# EAGLE design PIR_datalogger (EAGLE 7.7.0)
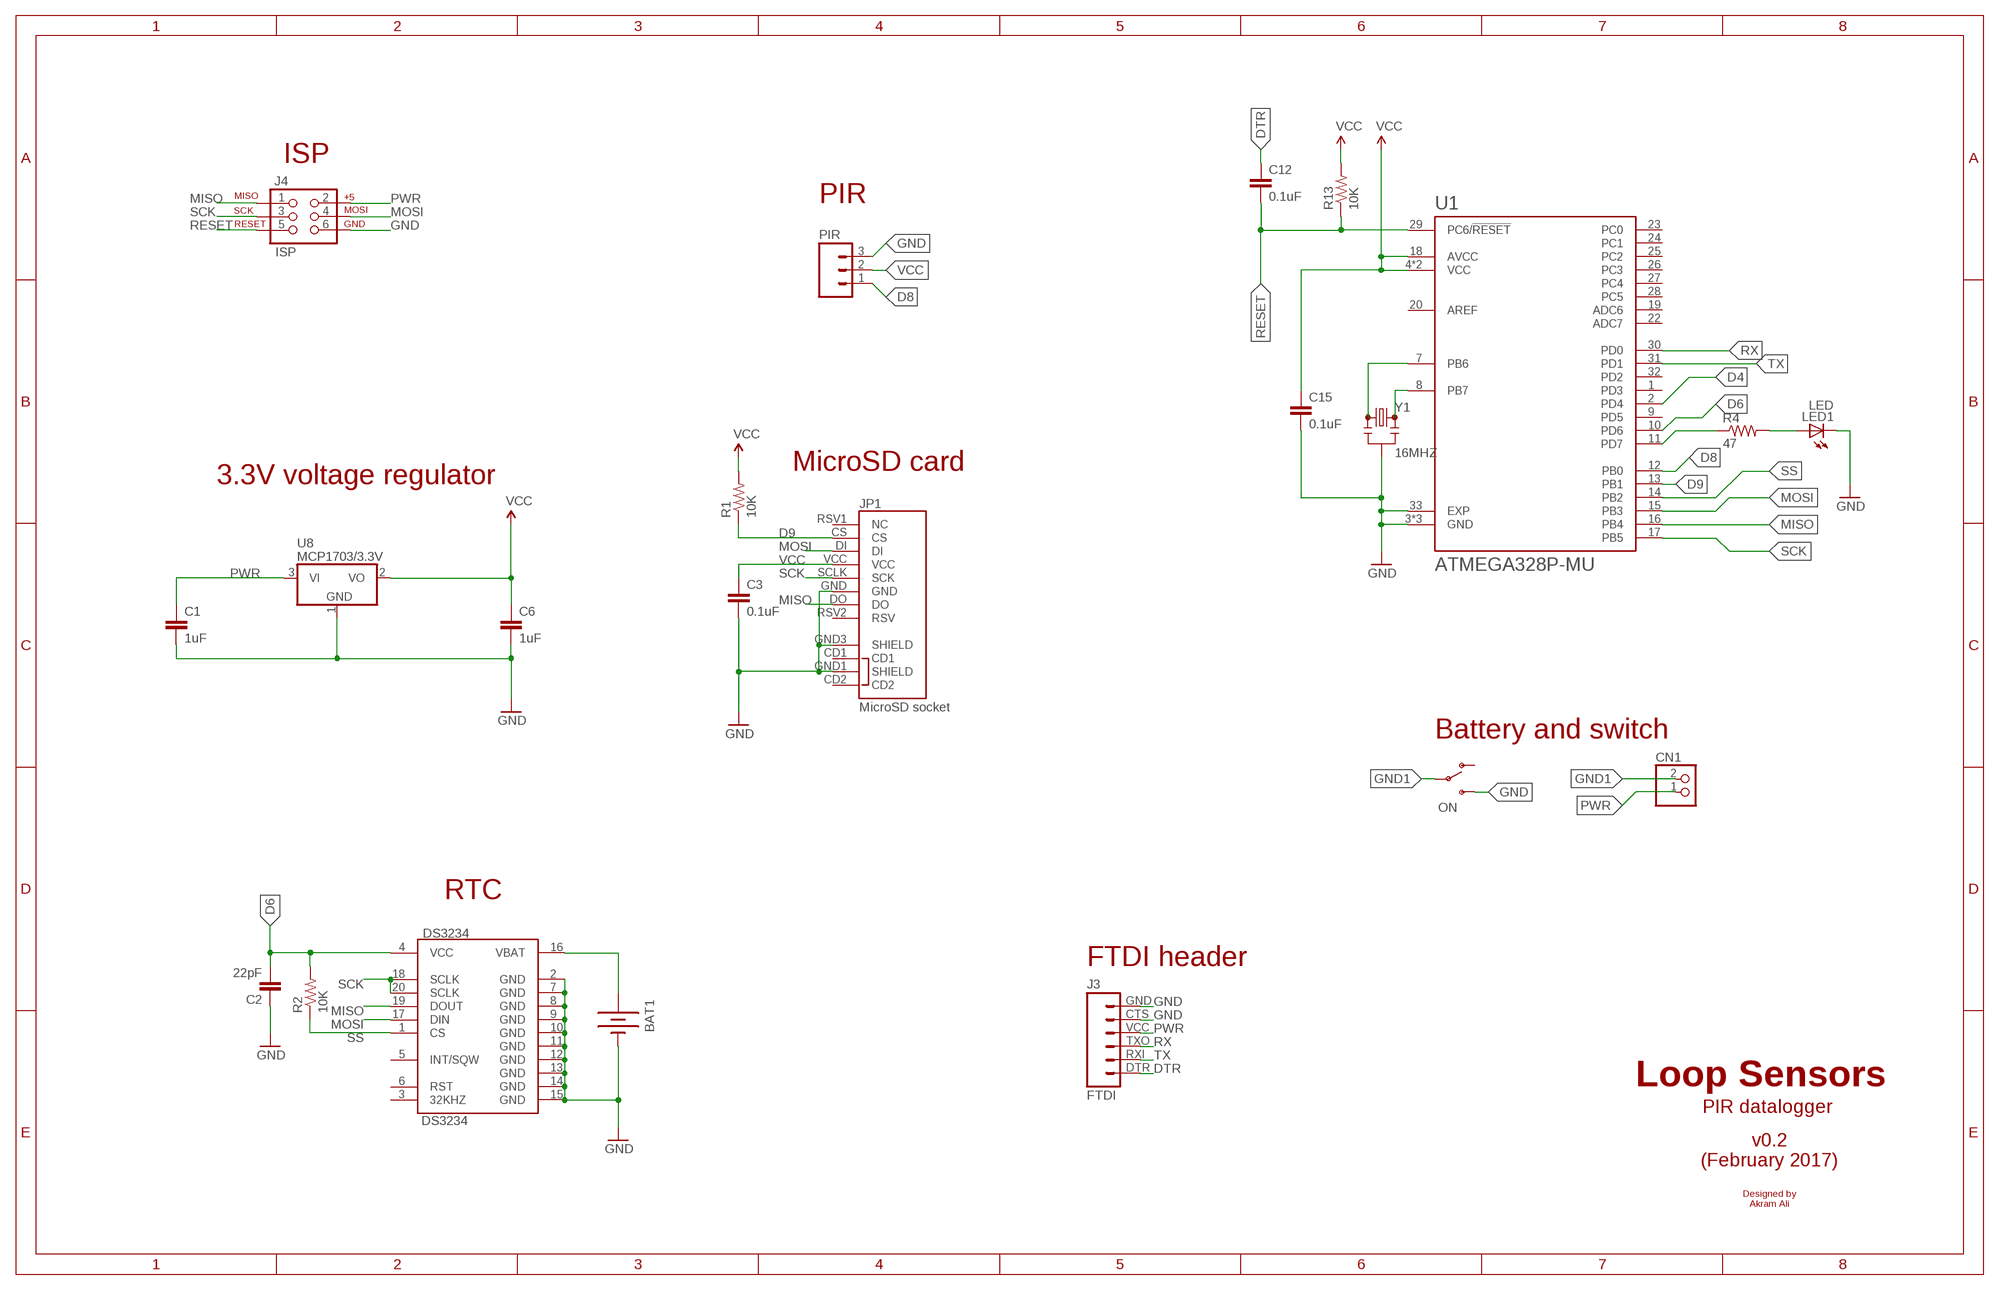
[diagram p0: schematic, sheet 1]

## Parts
BAT1  BATTERY12MM  [BATTCON_12MM]
C1  1uF  CAP0805  [0805]
C2  22pF  CAP0805  [0805]
C3  0.1uF  CAP0805  [0805]
C6  1uF  CAP0805  [0805]
C12  0.1uF  CAP0805  [0805]
C15  0.1uF  CAP0805  [0805]
CN1  JST_2PIN-SMT-RA  [JST-PH-2-SMT-RA]
DS3234  DS3234  [DS3234]
J3  FTDI  FTDI_BASICPTH  [FTDI_BASIC]
J4  ISP  AVR_SPI_PRG_6PTH  [2X3]
JP1  MicroSD socket  USD-SOCKETNEW  [MICRO-SD-SOCKET-PP]
LED1  LED  LEDCHIPLED_0805  [CHIPLED_0805]
ON  SWITCH-SPDT-SMD-A  [SWITCH-SPST-SMD-A]
PIR  M03PTH  [1X03]
R1  10K  RESISTOR0805-RES  [0805]
R2  10K  RESISTOR0805-RES  [0805]
R4  47  RESISTOR0805-RES  [0805]
R13  10K  RESISTOR0805-RES  [0805]
U1  ATMEGA328P-MU  [QFN50P500X500X100-33N]
U8  MCP1703/3.3V  MCP1703CB  [SOT23]
Y1  16MHZ  RESONATOR16MHZ  [RESONATOR-SMD]

## Nets
D4: U1.2(PD4)
D6: C2.2 DS3234.4(VCC) R2.2 U1.10(PD6)
D8: PIR.1 U1.12(PB0)
D9: JP1.CS R1.1 U1.13(PB1)
DTR: C12.1 J3.DTR
GND: BAT1.GND(-) C1.2 C2.1 C3.2 C6.2 C15.2 DS3234.2(GND) DS3234.7(GND) DS3234.8(GND) DS3234.9(GND) DS3234.10(GND) DS3234.11(GND) DS3234.12(GND) DS3234.13(GND) DS3234.14(GND) DS3234.15(GND) J3.CTS J3.GND J4.6 JP1.GND JP1.GND1(SHIELD) JP1.GND3(SHIELD) LED1.C ON.3(S) PIR.3 U1.3(GND) U1.5(GND) U1.21(GND) U1.33(EXP) U8.1(GND) Y1.2
GND1: CN1.2 ON.2(P)
MISO: DS3234.19(DOUT) J4.1 JP1.DO U1.16(PB4)
MOSI: DS3234.17(DIN) J4.4 JP1.DI U1.15(PB3)
N$1: R4.1 U1.11(PD7)
N$3: LED1.A R4.2
N$4: U1.8(PB7) Y1.3
N$5: U1.7(PB6) Y1.1
N$8: BAT1.PWR@1(+) DS3234.16(VBAT)
PWR: C1.1 CN1.1 J3.VCC J4.2 U8.3(VI)
RESET: C12.2 J4.5 R13.1 U1.29(PC6/!RESET)
RX: J3.TXO U1.30(PD0)
SCK: DS3234.18(SCLK) DS3234.20(SCLK) J4.3 JP1.SCLK(SCK) U1.17(PB5)
SS: DS3234.1(CS) R2.1 U1.14(PB2)
TX: J3.RXI U1.31(PD1)
VCC: C3.1 C6.1 C15.1 JP1.VCC PIR.2 R1.2 R13.2 U1.4(VCC) U1.6(VCC) U1.18(AVCC) U8.2(VO)
Unconnected: DS3234.3(32KHZ) DS3234.5(INT/SQW) DS3234.6(RST) JP1.CD1 JP1.CD2 JP1.RSV1(NC) JP1.RSV2(RSV) ON.1(O) U1.1(PD3) U1.9(PD5) U1.19(ADC6) U1.20(AREF) U1.22(ADC7) U1.23(PC0) U1.24(PC1) U1.25(PC2) U1.26(PC3) U1.27(PC4) U1.28(PC5) U1.32(PD2)

## Notes on the sheet
- ISP
- PIR
- MicroSD card
- 3.3V voltage regulator
- Battery and switch
- RTC
- FTDI header
- Loop Sensors
- PIR datalogger
- v0.2
  (February 2017)
- Designed by
  Akram Ali

## Library data of the parts
BAT1 = SparkFun-Electromechanical:BATTERY: Battery Holders Various common sizes : AA, AAA, 18650 (PRT-12895), 20mm coin cell and 12mm coin cell. 20MM_4LEGS, BATT-10373; MPN: 3000; PROD_ID: BATT-08044
C1 C6 = SparkFun-Capacitors:CAP: Capacitor Standard 0603 ceramic capacitor, and 0.1" leaded capacitor.; MPN: CC0805KKX7R7BB105
C2 C3 C12 C15 = SparkFun-Passives:CAP: Capacitor Standard 0603 ceramic capacitor, and 0.1" leaded capacitor.; MPN: AC0805KRX7R9BB104
CN1 = adafruit:JST_2PIN: JST 2-Pin Connectors of various flavors SMT-RA (S2B-PH-SM4) 4UConnector #17311 SMT (B2B-PH-SM4) THM-RA (S2B-PH) THM (B2B-PH)
DS3234 = SparkFun-FreqCtrl:DS3234: SPI RTC module with battery backup and internal clock.; MPN: DS3234S#
J3 = SparkFun-Connectors:FTDI_BASIC: FTDI Basic header with labels
J4 = SparkFun-Connectors:AVR_SPI_PRG_6: AVR ISP 6 Pin This is the reduced ISP connector for AVR programming. Common on Arduino. This footprint will take up less PCB space and can be used with a 10-pin to 6-pin adapter such as SKU: BOB-08508 **Special note about "TEST_POINT" package. The stop mask is on the top side, so if you want your programming test points to be on the bottom of your board, make sure to place this package on the bottom side of the board. This also ensure that the orientation to program from the bottom side will be correct.
JP1 = SparkFun-Connectors:USD-SOCKET: microSD Socket Push-push type uSD socket. Schematic element and footprint production proven. Spark Fun Electronics SKU : PRT-00127. tDoc lines correctly indicate media card edge positions when inserting (unlocked, locked, depressed). NOTE: CD1 and CD2 are connected internally; PROD_ID: CONN-07820
LED1 = adafruit:LED: LED OSRAM: - CHIPLED LG R971, LG N971, LY N971, LG Q971, LY Q971, LO R971, LY R971 LH N974, LH R974 LS Q976, LO Q976, LY Q976 LO Q996 - Hyper CHIPLED LW Q18S LB Q993, LB Q99A, LB R99A - SideLED LS A670, LO A670, LY A670, LG A670, LP A670 LB A673, LV A673, LT A673, LW A673 LH A674 LY A675 LS A676, LA A676, LO A676, LY A676, LW A676 LS A679, LY A679, LG A679 - Hyper Micro SIDELED® LS Y876, LA Y876, LO Y876, LY Y876 LT Y87S - SmartLED LW L88C, LW L88S LB L89C, LB L89S, LG L890 LS L89K, LO L89K, LY L89K LS L896, LA L896, LO L896, LY L896 - TOPLED LS T670, LO T670, LY T670, LG T670, LP T670 LSG T670, LSP T670, LSY T670, LOP T670, LYG T670 LG T671, LOG T671, LSG T671 LB T673, LV T673, LT T673, LW T673 LH T674 LS T676, LA T676, LO T676, LY T676, LB T676, LH T676, LSB T676, LW T676 LB T67C, LV T67C, LT T67C, LS T67K, LO T67K, LY T67K, LW E67C LS E67B, LA E67B, LO E67B, LY E67B, LB E67C, LV E67C, LT E67C LW T67C LS T679, LY T679, LG T679 LS T770, LO T770, LY T770, LG T770, LP T770 LB T773, LV T773, LT T773, LW T773 LH T774 LS E675, LA E675, LY E675, LS T675 LS T776, LA T776, LO T776, LY T776, LB T776 LHGB T686 LT T68C, LB T68C - Hyper Mini TOPLED® LB M676 - Mini TOPLED Santana® LG M470 LS M47K, LO M47K, LY M47K Source: http://www.osram.convergy.de/; MPN: 150080BS75000
ON = SparkFun-Electromechanical:SWITCH-SPDT: SPDT Switch Simple slide switch, Spark Fun Electronics SKU : COM-00102 DPDT SMT slide switch, AYZ0202, SWCH-08179; PROD_ID: SWCH-10651
PIR = SparkFun-Connectors:M03: Header 3 Standard 3-pin 0.1" header. Use with straight break away headers (SKU : PRT-00116), right angle break away headers (PRT-00553), swiss pins (PRT-00743), machine pins (PRT-00117), and female headers (PRT-00115). Molex polarized connector foot print use with SKU : PRT-08232 with associated crimp pins and housings.
R1 R2 R13 = SparkFun-Passives:RESISTOR: Resistor Basic schematic elements and footprints for 0603, 1206, and PTH resistors.; MPN: RC0805JR-0710KL
R4 = SparkFun-Resistors:RESISTOR: Resistor Basic schematic elements and footprints for 0603, 1206, and PTH resistors.; MPN: RC0805JR-0747RL
U1 = ATMEGA328P-MU:ATMEGA328P-MU: ATmega Series 20 MHz 32 KB Flash 2 KB SRAM 8-Bit Microcontroller - QFN-32; AVAILABILITY: Good; DESCRIPTION: ATmega Series 20 MHz 32 KB Flash 2 KB SRAM 8-Bit Microcontroller - QFN-32; MF: Atmel; MP: ATMEGA328P-MU; PACKAGE: QFN-32 Atmel; PRICE: 2.55 USD
U8 = linear:MCP1703: 250 mA, 16V, Low Quiescent Current LDO Regulator Source: http://ww1.microchip.com/downloads/en/DeviceDoc/22049b.pdf; MPN: MCP1703T-2502E/CB
Y1 = SparkFun-FreqCtrl:RESONATOR: Resonator Small SMD resonator. Used, eg, on the Arduino Pro/ Pro Mini boards. 8MHz- XTAL-08895 16MHz- XTAL-08900; MPN: CSTCE16M0V53-R0; PROD_ID: XTAL-08900

## Board
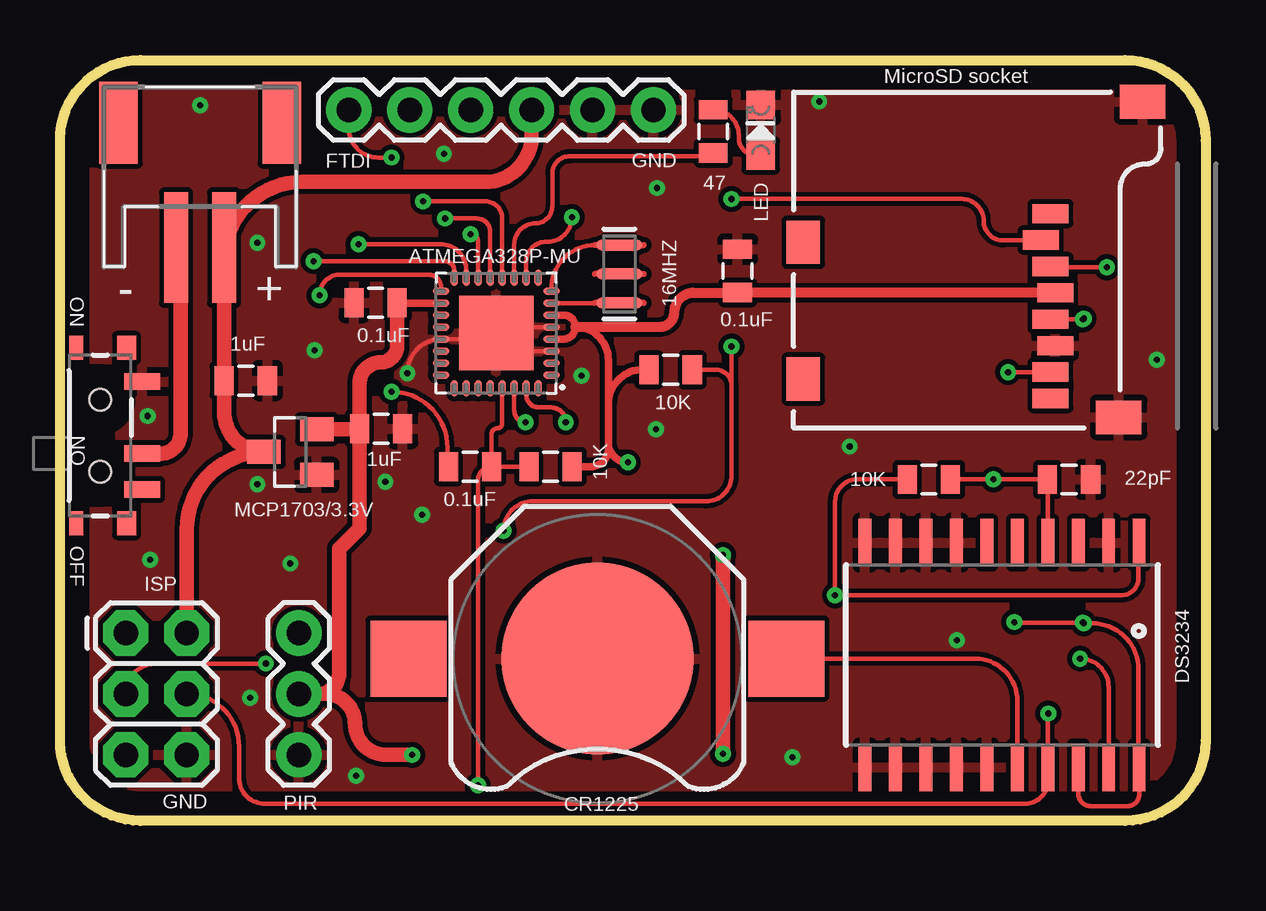
[diagram p1: board, top side]
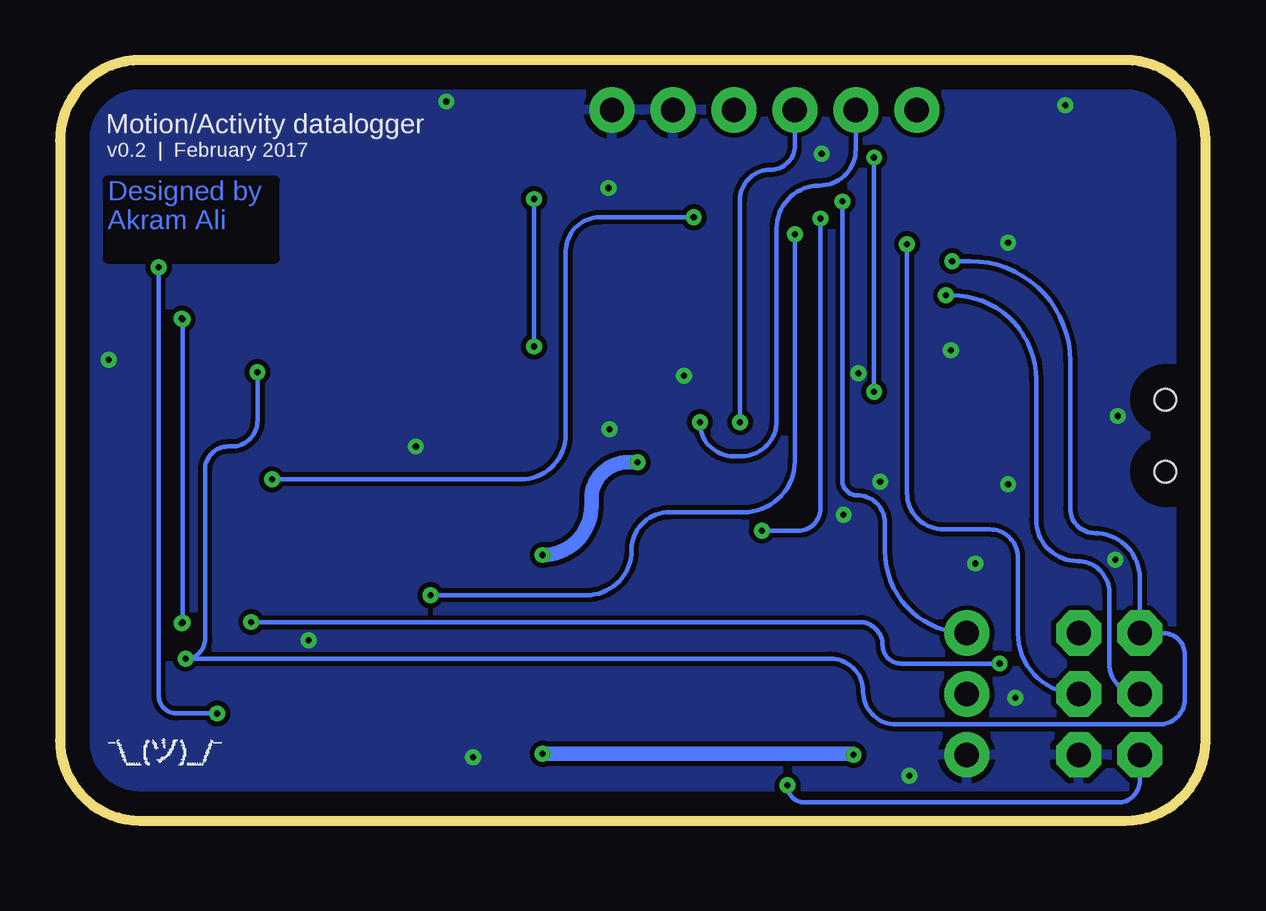
[diagram p2: board, bottom side, seen from below]

Size 47.75 x 31.7 mm. Coordinates in mm from the lower left corner, seen from the top.
Outline: 3.35,31.7 44.4,31.7 arc-90 47.75,28.35 47.75,3.35 arc-90 44.4,0 3.35,0 arc-90 0,3.35 0,28.35 arc-90 3.35,31.7
Copper layers (1*16): Top 0.035mm / dielectric 1.5mm / Bottom 0.035mm
Design rules "default": minimum track width 10mil, minimum drill 24mil, track to track 8mil, track to pad 8mil, pad to pad 8mil, via to via 8mil, smd to smd 8mil, copper to edge 40mil, drill to drill 8mil, minimum pad ring 10mil, minimum via ring 8mil, stop-mask expansion 4mil, vias tented up to drill 0mil, thermal gap 10mil

### Footprints (pad centres in the part's own frame; a part is rotated, then mirrored left to right if it is on the bottom)
BATTCON_12MM = smd 8 x 8: GND 0,0 | smd 3.175 x 3.175: PWR@1 -7.874,0; PWR@2 7.874,0
0805 = smd 0.8 x 1.2: 1 -0.9,0; 2 0.9,0
JST-PH-2-SMT-RA = smd 1 x 4.6: 1 1,-3.7; 2 -1,-3.7 | smd 1.6 x 3.4: NC1 -3.4,1.5; NC2 3.4,1.5
DS3234 = smd 0.53 x 1.98: 1 -5.715,-4.685; 2 -4.445,-4.685; 3 -3.175,-4.685; 4 -1.905,-4.685; 5 -0.635,-4.685; 6 0.635,-4.685; 7 1.905,-4.685; 8 3.175,-4.685; 9 4.445,-4.685; 10 5.715,-4.685; 11 5.715,4.685; 12 4.445,4.685; 13 3.175,4.685; 14 1.905,4.685; 15 0.635,4.685; 16 -0.635,4.685; 17 -1.905,4.685; 18 -3.175,4.685; 19 -4.445,4.685; 20 -5.715,4.685
FTDI_BASIC = drill 1.016 pad 1.88: CTS 10.16,0; DTR 0,0; GND 12.7,0; RXI 2.54,0; TXO 5.08,0; VCC 7.62,0
2X3 = drill 1.016 pad 1.88 octagon: 1 0,0; 2 0,2.54; 3 2.54,0; 4 2.54,2.54; 5 5.08,0; 6 5.08,2.54
MICRO-SD-SOCKET-PP = smd 1.8 x 1.4: CD1 -2.05,0.4; CD2 -7.75,0.4 | smd 0.8 x 1.5: CS -7.84,10.3; DI -6.74,10.7; DO -2.34,10.7; GND -3.44,10.9; RSV1 -8.94,10.7; RSV2 -1.24,10.7; SCLK -4.54,10.7; VCC -5.64,10.9 | smd 1.4 x 1.9: GND1 -13.6,14.55; GND3 -0.45,13.55
CHIPLED_0805 = smd 1.2 x 1.2: A 0,-1.05; C 0,1.05
SWITCH-SPST-SMD-A = smd 0.7 x 1.5: 1 -2.25,-1.75; 2 -0.75,-1.75; 3 2.25,-1.75 | smd 1 x 0.6: GND1 -3.65,1; GND3 3.65,1 | smd 1 x 0.8: GND2 -3.65,-1.1; GND4 3.65,-1.1 | hole 0.9: -1.5,0; 1.5,0
1X03 = drill 1.016 pad 1.88: 1 0,0; 2 2.54,0; 3 5.08,0
QFN50P500X500X100-33N = smd 0.7 x 0.3: 1 -2.3,1.75; 2 -2.3,1.25; 3 -2.3,0.75; 4 -2.3,0.25; 5 -2.3,-0.25; 6 -2.3,-0.75; 7 -2.3,-1.25; 8 -2.3,-1.75; 17 2.3,-1.75; 18 2.3,-1.25; 19 2.3,-0.75; 20 2.3,-0.25; 21 2.3,0.25; 22 2.3,0.75; 23 2.3,1.25; 24 2.3,1.75 | smd 0.3 x 0.7: 9 -1.75,-2.3; 10 -1.25,-2.3; 11 -0.75,-2.3; 12 -0.25,-2.3; 13 0.25,-2.3; 14 0.75,-2.3; 15 1.25,-2.3; 16 1.75,-2.3; 25 1.75,2.3; 26 1.25,2.3; 27 0.75,2.3; 28 0.25,2.3; 29 -0.25,2.3; 30 -0.75,2.3; 31 -1.25,2.3; 32 -1.75,2.3 | smd 3.1 x 3.1: 33 0,0
SOT23 = smd 1 x 1.4: 1 -0.95,-1.1; 2 0.95,-1.1; 3 0,1.1
RESONATOR-SMD = smd 0.45 x 1.905: 1 -1.2,0; 2 0,0; 3 1.2,0

### Placement (x,y rotation side)
BAT1  22.4,6.76 180 top
C1  7.75,18.34 0 top
C2  42.06,14.22 180 top
C3  28.24,22.91 90 top
C6  13.39,16.33 0 top
C12  17.09,14.76 0 top
C15  13.16,21.59 180 top
CN1  5.84,27.58 0 top
DS3234  39.27,6.91 180 top
J3  12.04,29.62 0 top
J4  2.74,7.82 270 top
JP1  30.58,16.36 270 top
LED1  29.21,28.78 0 top
ON  1.68,16.05 90 top
PIR  9.96,7.82 270 top
R1  25.45,18.8 180 top
R2  36.22,14.22 0 top
R4  27.23,28.73 90 top
R13  20.45,14.76 0 top
U1  18.19,20.32 180 top
U8  9.6,15.37 90 top
Y1  23.32,22.78 90 top

### Tracks (layer width: path | path; a pad name or v marks a point on that pad's centre or on a via)
D6  (via drill 0.25 pad 0.13)
  Top 0.178: DS3234.4 41.17,14.21 arc90 C2.2 v38.91,14.22 R2.2 | U1.10 19.44,23.3 arc-90 20.27,24.13 20.32,24.13 arc90 v21.34,25.15
  Bottom 0.178: v21.34,25.15 25.25,25.15 arc-90 26.67,23.72 26.67,16.1 arc90 28.55,14.22 v38.91,14.22
D8  (via drill 0.25 pad 0.13)
  Top 0.178: U1.12 18.44,25.1 arc90 17.73,25.81 v15.14,25.81
  Bottom 0.178: v15.14,25.81 15.14,14.17 arc-90 14.53,13.56 arc90 13.36,12.4 13.36,11.23 arc-90 PIR.1
D9  (via drill 0.25 pad 0.13)
  Top 0.178: U1.13 17.94,24.53 arc90 17.37,25.1 v16.05,25.1 | 40.87,24.18 arc90 JP1.CS arc-90 40.87,24.18 | 27.99,18.14 27.99,14.38 arc-90 26.92,13.31 19.71,13.31 arc90 v18.49,12.09 | R1.1 27.33,18.8 arc-90 27.99,18.14 | 27.99,18.14 v27.99,19.76 | v27.99,25.91 37.59,25.91 arc-90 38.51,24.99 arc90 39.32,24.18 40.87,24.18
  Bottom 0.178: v16.05,25.1 16.05,13 arc90 16.97,12.09 v18.49,12.09 | v27.99,19.76 v27.99,25.91
DTR  (via drill 0.25 pad 0.13)
  Top 0.178: J3.DTR 12.04,28.85 arc90 13.26,27.64 v13.82,27.64 | C12.1 arc-90 16.15,14.8 16.15,15.54 arc90 v13.82,17.88
  Bottom 0.178: v13.82,27.64 v13.82,17.88
GND  (via drill 0.25 pad 0.13)
  Top 0.178: U1.33 arc-90 17.94,20.07 U1.21 arc90 14.48,18.66 v14.48,18.64 | U1.5 18.44,20.57 arc90 U1.33 | U1.3 18.94,19.57 arc-90 U1.33
  other vias: 5.84,29.82 7.92,5.13 3.66,16.87 8.23,24.08 24.89,26.37 30.53,2.64 45.72,19.2 10.62,19.61 3.76,10.87 16,27.79 9.6,10.72 37.39,7.52 15.09,12.75 13.56,14.12 8.23,14.02 24.84,16.31 32.92,15.6 12.34,1.88 21.74,18.54 31.65,29.97
  pour Bottom: -0.25,32.51 48.56,32.51 48.56,-0.66 -0.66,-0.66 -0.66,32.51
  pour Top: -0.66,32.51 48.56,32.51 48.56,-0.66 -0.66,-0.66
GND1
  Top 0.61: CN1.2 arc-90 5.03,23.7 5.03,16.15 arc-90 4.17,15.29 3.44,15.29 arc-90 ON.2
MISO  (via drill 0.25 pad 0.13)
  Top 0.178: U1.16 16.44,22.93 arc90 16.05,23.32 v10.57,23.32 | JP1.DO v39.53,18.7 arc90 v39.52,18.69 | v42.52,6.76 arc-90 43.71,5.56 DS3234.19
  Bottom 0.178: v10.57,23.32 9.8,23.32 arc90 5.64,19.15 5.64,13 arc-90 4.62,11.99 arc90 2.74,10.11 J4.1 1.78,7.82 arc90 0.86,6.91 0.86,5.08 arc90 1.93,4.01 12.9,4.01 arc90 14.28,5.38 arc-90 15.65,6.76 v42.52,6.76 arc-90 41.71,7.57 41.71,14.63 arc90 40.74,15.6 40.59,15.6 arc-90 39.52,16.66 v39.52,18.69
MOSI  (via drill 0.25 pad 0.13)
  Top 0.178: U1.15 16.94,22.94 arc90 15.85,24.03 v12.45,24.03 | v43.64,23.06 41.32,23.06 arc-90 JP1.DI | 41.17,4.44 arc-90 v41.2,4.47 arc90 41.17,4.44 | J4.4 arc-90 7.47,3.1 7.47,1.78 arc90 8.53,0.71 40.23,0.71 arc90 41.17,1.65 DS3234.17 41.17,4.44
  Bottom 0.178: J4.4 arc90 7.82,7.82 7.82,10.97 arc-90 8.99,12.14 10.92,12.14 arc90 12.45,13.67 v12.45,24.03 | v43.64,23.06 43.64,5.23 arc-90 42.88,4.47 v41.2,4.47
N$1
  Top 0.178: U1.11 18.94,24.02 arc-90 19.81,24.89 arc90 20.52,25.6 20.52,26.97 arc-90 21.23,27.69 27.09,27.69 arc90 R4.1
N$3
  Top 0.178: LED1.A arc90 LED1.A 29.02,27.73 arc-90 28.3,28.45 28.3,28.56 arc90 R4.2
N$4
  Top 0.178: U1.8 20.49,22.17 arc-90 22.3,23.98
N$5
  Top 0.178: U1.7 22.29,21.57 arc90 22.3,21.58
N$8
  Top 0.178: DS3234.16 39.9,5 arc90 38.15,6.76 BAT1.PWR@1
PWR
  Top 0.61: CN1.1 6.84,23.37 | 6.84,23.37 C1.1 arc90 C1.1 6.85,17.02 arc90 U8.3 arc90 5.28,12.15 J4.2 | J3.VCC 19.66,28.55 arc-90 17.73,26.62 10.09,26.62 arc90 6.84,23.37
RESET  (via drill 0.25 pad 0.13)
  Top 0.178: C12.2 R13.1 | C12.2 17.99,16.11 arc-90 18.24,16.36 arc90 18.44,16.56 U1.29 | C12.2 arc90 17.42,14.19 v17.42,1.47
  Bottom 0.178: J4.5 2.74,1.68 arc90 3.66,0.76 16.71,0.76 arc90 v17.42,1.47
RX  (via drill 0.25 pad 0.13)
  Top 0.178: U1.30 18.94,17.08 arc90 v19.41,16.61
  Bottom 0.178: v19.41,16.61 19.41,25.86 arc90 18.14,27.13 arc-90 17.12,28.14 J3.TXO
SCK  (via drill 0.25 pad 0.13)
  Top 0.178: U1.17 15.89,22.21 arc90 15.34,22.76 11.68,22.76 arc90 v10.82,21.89 | JP1.SCLK v42.64,20.9 arc90 v42.67,20.93 | v42.67,8.23 43.03,8.23 arc-90 44.96,6.3 44.96,2.25 arc90 DS3234.20 44.98,1.09 arc-90 44.5,0.61 42.98,0.61 arc-90 42.44,1.14 DS3234.18 | v42.64,8.26 39.8,8.26 arc-90 v39.78,8.28 | v8.59,6.55 4.01,6.55 arc90 J4.3
  Bottom 0.178: v10.82,21.89 10.57,21.89 arc90 7.06,18.39 7.06,12.55 arc-90 5.33,10.82 arc90 4.01,9.5 4.01,6.55 arc-90 J4.3 | v42.67,8.23 arc-90 v42.64,8.26 v42.64,20.9 arc-90 v42.67,20.93 | v39.78,8.28 14.43,8.28 arc90 13.46,7.32 arc-90 12.7,6.55 v8.59,6.55
SS  (via drill 0.25 pad 0.13)
  Top 0.178: U1.14 17.44,24.12 arc90 v17.12,24.43 | DS3234.1 arc90 44.96,11.57 44.96,10.11 arc-90 44.25,9.4 v32.31,9.4 32.31,13.31 arc-90 33.22,14.22 R2.1
  Bottom 0.178: v32.31,9.4 25.81,9.4 arc-90 23.93,11.28 arc90 22.35,12.85 19.25,12.85 | 19.15,12.85 19.25,12.85 | v17.12,24.43 17.12,14.99 arc90 19.25,12.85
TX  (via drill 0.25 pad 0.13)
  Top 0.178: U1.31 19.44,17.75 arc90 19.96,17.22 20.47,17.22 arc-90 v21.08,16.61
  Bottom 0.178: v21.08,16.61 21.08,16.51 arc-90 19.56,15.19 19.36,15.19 arc-90 17.88,16.66 17.88,24.69 arc90 16.1,26.47 arc-90 14.58,27.99 J3.RXI
VCC  (via drill 0.25 pad 0.13)
  Top 0.305: U1.18 14.08,21.57 arc-90 C15.1 | U1.6 20.99,21.07 arc-90 21.49,20.57 | 21.49,20.57 arc-90 20.98,20.07 U1.4 | R13.2 22.12,14.76 arc90 22.86,15.49 22.86,15.75 | 22.86,15.75 22.86,17.37 | 22.86,17.37 22.86,19.2 arc90 21.49,20.57 | v23.67,14.94 arc-90 22.86,15.75 | R1.2 24.28,18.8 arc90 22.86,17.37
  Top 0.406: 21.49,20.57 24.99,20.57 arc90 25.6,21.18 arc-90 26.42,22 28.23,22 arc90 C3.1 arc90 28.26,22 JP1.VCC
  Top 0.61: U8.2 12.47,16.32 arc90 C6.1 | C6.1 12.49,18.23 arc-90 13.36,19.1 arc90 14.06,19.8 C15.1 | C6.1 12.5,16.32 12.5,12.19 11.63,11.33 11.63,6.15 arc-90 10.77,5.28 PIR.2 11.07,5.28 arc-90 12.29,4.06 arc90 13.61,2.74 v14.68,2.74 | v27.63,2.79 v27.63,11.07
  Bottom 0.61: v14.68,2.74 14.68,2.79 v27.63,2.79 | v23.67,14.94 24.08,14.94 arc-90 25.6,13.41 25.6,13.11 arc90 v27.63,11.07

### Text on the board
Bottom: Designed by / Akram Ali
_tsilk: GND | ON | OFF | GND | CR1225
_bsilk: Motion/Activity datalogger | v0.2 | February 2017